# Altium schematic sheet 1010829PA_HVFlyback_GD_Testboard_Flyback.SchDoc: Flyback
size A4; CompanyName: drivetek ag; DrawnBy: NLE; Address1: industriestrasse 37; Address2: 2555 brügg; Address3: Switzerland; SheetNumber: 2; SheetTotal: 2
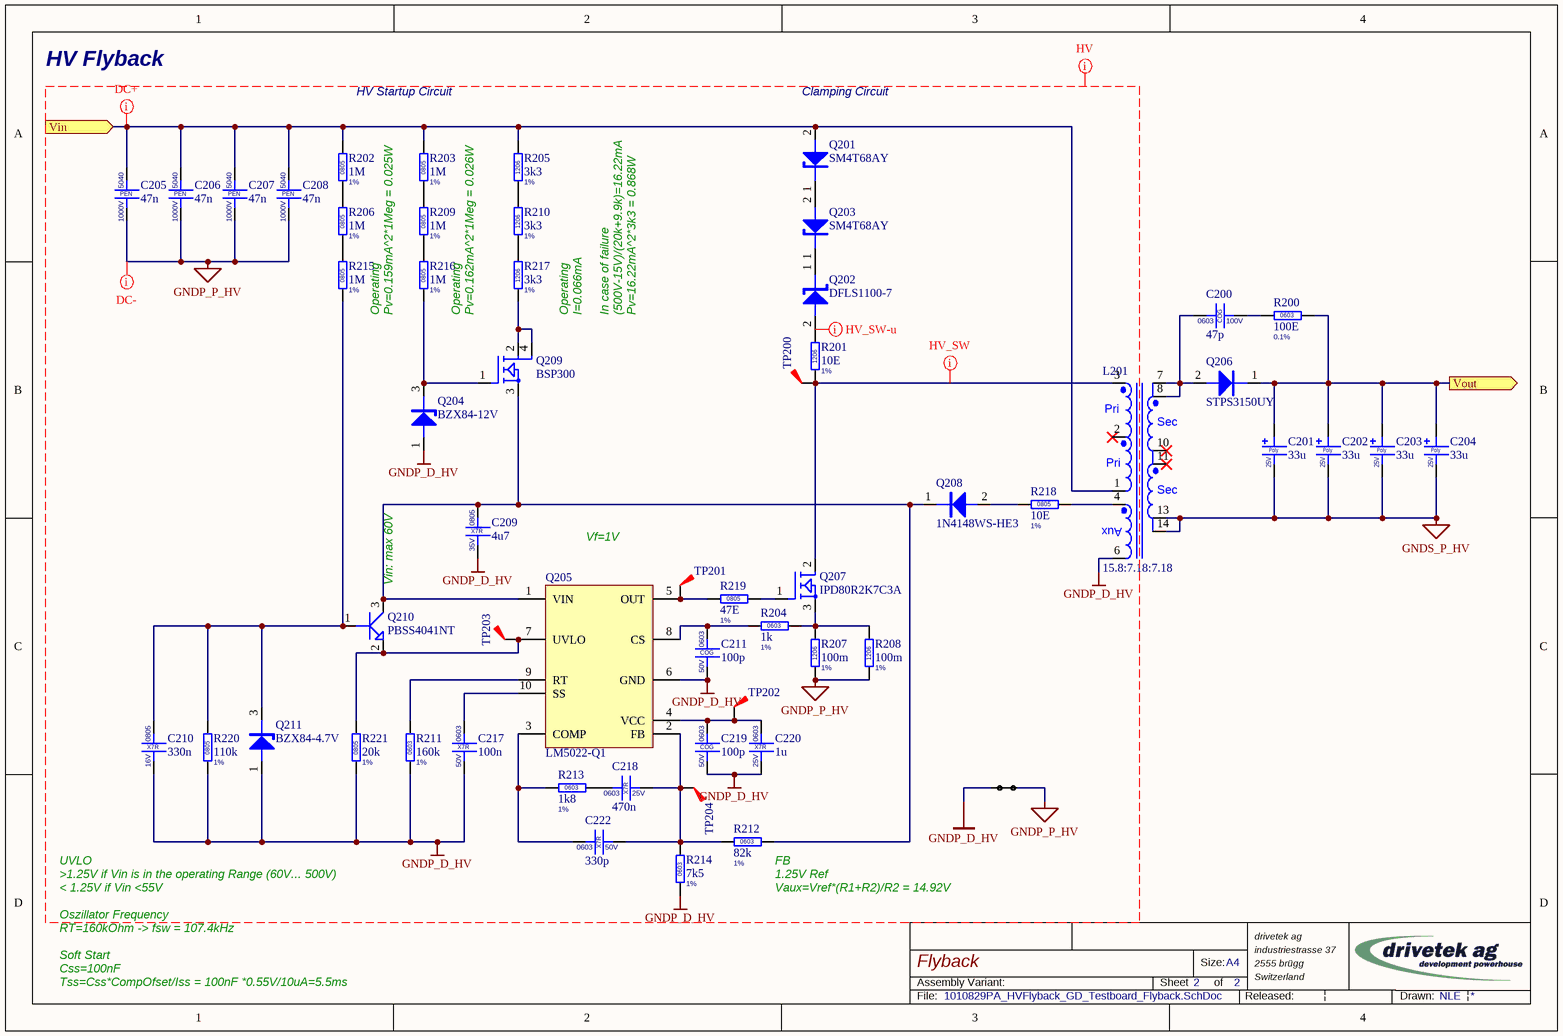
[diagram p0: 1010829PA_HVFlyback_GD_Testboard_Flyback.SchDoc]

## Parts
C200  47p  CaseName: 0603  Type3: COG  Voltage: 100V  [02_0603_DRK_1-7x1-0x0-9]
C201  33u  Voltage: 25V  Type2: Poly  [02_ELKO-SMD-4x7-4_DRK_4-3x7-3x1-9]
C202  33u  Voltage: 25V  Type2: Poly  [02_ELKO-SMD-4x7-4_DRK_4-3x7-3x1-9]
C203  33u  Voltage: 25V  Type2: Poly  [02_ELKO-SMD-4x7-4_DRK_4-3x7-3x1-9]
C204  33u  Voltage: 25V  Type2: Poly  [02_ELKO-SMD-4x7-4_DRK_4-3x7-3x1-9]
C205  47n  CaseName: 5040  Type3: PEN  Voltage: 1000V  [02_5040_DRK_3-5mm]
C206  47n  CaseName: 5040  Type3: PEN  Voltage: 1000V  [02_5040_DRK_3-5mm]
C207  47n  CaseName: 5040  Type3: PEN  Voltage: 1000V  [02_5040_DRK_3-5mm]
C208  47n  CaseName: 5040  Type3: PEN  Voltage: 1000V  [02_5040_DRK_3-5mm]
C209  4u7  CaseName: 0805  Type3: X7R  Voltage: 35V  [02_0805_DRK_2-2x1-5x1-3]
C210  330n  CaseName: 0805  Type3: X7R  Voltage: 16V  [02_0805_DRK_2-2x1-5x1-3]
C211  100p  CaseName: 0603  Type3: COG  Voltage: 50V  [02_0603_DRK_1-7x1-0x0-9]
C217  100n  CaseName: 0603  Type3: X7R  Voltage: 50V  [02_0603_DRK_1-7x1-0x0-9]
C218  470n  CaseName: 0603  Type3: X7R  Voltage: 25V  [02_0603_DRK_1-7x1-0x0-9]
C219  100p  CaseName: 0603  Type3: COG  Voltage: 50V  [02_0603_DRK_1-7x1-0x0-9]
C220  1u  CaseName: 0603  Type3: X7R  Voltage: 25V  [02_0603_DRK_1-7x1-0x0-9]
C222  330p  CaseName: 0603  Type3: X7R  Voltage: 50V  [02_0603_DRK_1-7x1-0x0-9]
J200  3x1top  [12_NetCon_top_3x1]  (value not drawn)  (net tie, no BOM)
L201  15.8:7.18:7.18  [06_TRA_DRK_WUERTH-750871630]
Q201  SM4T68AY  [03_SMA_DRK]
Q202  DFLS1100-7  [03_POWERDI_DRK]
Q203  SM4T68AY  [03_SMA_DRK]
Q204  BZX84-12V  [03_SOT23_DRK]
Q205  LM5022-Q1  [04_VSSOP-10_DRK]
Q206  STPS3150UY  [03_SMB_DRK]
Q207  IPD80R2K7C3A  [03_PG-TO252-3-11]
Q208  1N4148WS-HE3  [03_SOD323_DRK]
Q209  BSP300  [03_SOT-223_DRK]
Q210  PBSS4041NT  [03_SOT23_DRK]
Q211  BZX84-4.7V  [03_SOT23_DRK]
R200  100E  Tolerance: 0.1%  CaseName: 0603  [01_0603_DRK_1-7x1-0x0-55]
R201  10E  Tolerance: 1%  CaseName: 1206  [01_1206_DRK_3-4x1-8x0-65]
R202  1M  Tolerance: 1%  CaseName: 0805  [01_0805_DRK_2-2x1-5x0-65]
R203  1M  Tolerance: 1%  CaseName: 0805  [01_0805_DRK_2-2x1-5x0-65]
R204  1k  Tolerance: 1%  CaseName: 0603  [01_0603_DRK_1-7x1-0x0-55]
R205  3k3  Tolerance: 1%  CaseName: 1206  [01_1206_DRK_3-4x1-8x0-65]
R206  1M  Tolerance: 1%  CaseName: 0805  [01_0805_DRK_2-2x1-5x0-65]
R207  100m  Tolerance: 1%  CaseName: 1206  [01_1206_DRK_3-4x1-8x0-65]
R208  100m  Tolerance: 1%  CaseName: 1206  [01_1206_DRK_3-4x1-8x0-65]
R209  1M  Tolerance: 1%  CaseName: 0805  [01_0805_DRK_2-2x1-5x0-65]
R210  3k3  Tolerance: 1%  CaseName: 1206  [01_1206_DRK_3-4x1-8x0-65]
R211  160k  Tolerance: 1%  CaseName: 0603  [01_0603_DRK_1-7x1-0x0-55]
R212  82k  Tolerance: 1%  CaseName: 0603  [01_0603_DRK_1-7x1-0x0-55]
R213  1k8  Tolerance: 1%  CaseName: 0603  [01_0603_DRK_1-7x1-0x0-55]
R214  7k5  Tolerance: 1%  CaseName: 0603  [01_0603_DRK_1-7x1-0x0-55]
R215  1M  Tolerance: 1%  CaseName: 0805  [01_0805_DRK_2-2x1-5x0-65]
R216  1M  Tolerance: 1%  CaseName: 0805  [01_0805_DRK_2-2x1-5x0-65]
R217  3k3  Tolerance: 1%  CaseName: 1206  [01_1206_DRK_3-4x1-8x0-65]
R218  10E  Tolerance: 1%  CaseName: 0805  [01_0805_DRK_2-2x1-5x0-65]
R219  47E  Tolerance: 1%  CaseName: 0805  [01_0805_DRK_2-2x1-5x0-65]
R220  110k  Tolerance: 1%  CaseName: 0805  [01_0805_DRK_2-2x1-5x0-65]
R221  20k  Tolerance: 1%  CaseName: 0805  [01_0805_DRK_2-2x1-5x0-65]
TP200  TP SMD 1mm  [13_TP_1mm]  (value not drawn)  (no BOM)
TP201  TP SMD 1mm  [13_TP_1mm]  (value not drawn)  (no BOM)
TP202  TP SMD 1mm  [13_TP_1mm]  (value not drawn)  (no BOM)
TP203  TP SMD 1mm  [13_TP_1mm]  (value not drawn)  (no BOM)
TP204  TP SMD 1mm  [13_TP_1mm]  (value not drawn)  (no BOM)

## Ports
Vin (in), Vout (out)

## Nets
GNDP_D_HV: C209.2 C210.2 C211.2 C217.2 C219.2 C220.2 J200.1 L201.6 Q204.1 Q205.6(GND) Q211.1 R211.1 R214.1 R220.1 R221.1
GNDP_P_HV: C205.2 C206.2 C207.2 C208.2 J200.2 R207.1 R208.1
GNDS_P_HV: C201.2 C202.2 C203.2 C204.2 L201.13 L201.14
Vin: C205.1 C206.1 C207.1 C208.1 L201.1 Q201.2 R202.2 R203.2 R205.2 ; port Vin
Vout: C201.1 C202.1 C203.1 C204.1 Q206.1 R200.2 ; port Vout
NetC200_1: C200.1 L201.7 L201.8 Q206.2
NetC200_2: C200.2 R200.1
NetC209_1: C209.1 Q205.1(VIN) Q208.1 Q209.3 Q210.3 R212.2
NetC210_1: C210.1 Q210.1 Q211.3 R215.1 R220.2
NetC211_1: C211.1 Q205.8(CS) R204.1
NetC217_1: C217.1 Q205.10(SS)
NetC218_1: C218.1 R213.2
NetC218_2: C218.2 C222.2 Q205.2(FB) R212.1 R214.2 TP204.1
NetC219_1: C219.1 C220.1 Q205.4(VCC) TP202.1
NetC222_1: C222.1 Q205.3(COMP) R213.1
NetL201_3: L201.3 Q207.2 R201.2 TP200.1
NetL201_4: L201.4 R218.2
NetQ201_1: Q201.1 Q203.2
NetQ202_1: Q202.1 Q203.1
NetQ202_2: Q202.2 R201.1
NetQ204_3: Q204.3 Q209.1 R216.1
NetQ205_5: Q205.5(OUT) R219.1 TP201.1
NetQ205_7: Q205.7(UVLO) Q210.2 R221.2 TP203.1
NetQ205_9: Q205.9(RT) R211.2
NetQ207_1: Q207.1 R219.2
NetQ207_3: Q207.3 R204.2 R207.2 R208.2
NetQ208_2: Q208.2 R218.1
NetQ209_2: Q209.2 Q209.4 R217.1
NetR202_1: R202.1 R206.2
NetR203_1: R203.1 R209.2
NetR205_1: R205.1 R210.2
NetR206_1: R206.1 R215.2
NetR209_1: R209.1 R216.2
NetR210_1: R210.1 R217.2

Not connected (* = marked no-connect by the designer): L201 2* 10(7)* 11*

## Layout directives
net class HV: GNDP_D_HV, GNDP_P_HV
net class DC+: Vin
net class DC-: GNDP_P_HV
net class HV_SW: NetL201_3
net class HV_SW-u: NetQ202_2

## Notes on the sheet
- HV Flyback
- HV Startup Circuit
- (near Q201) Clamping Circuit
- Operating
- Pv=0.159mA^2*1Meg = 0.025W
- Pv=0.162mA^2*1Meg = 0.026W
- I=0.066mA
- In case of failure
- (500V-15V)/(20k+9.9k)=16.22mA
- Pv=16.22mA^2*3k3 = 0.868W
- (near Q210) Vin: max 60V
- Vf=1V
- >1.25V if Vin is in the operating Range (60V... 500V)
- < 1.25V if Vin <55V
- UVLO
- Oszillator Frequency
- (near R212) 1.25V Ref
- (near R212) FB
- (near R212) Vaux=Vref*(R1+R2)/R2 = 14.92V
- RT=160kOhm -> fsw = 107.4kHz
- Soft Start
- Css=100nF
- Tss=Css*CompOfset/Iss = 100nF *0.55V/10uA=5.5ms
- Assembly Variant:
- Sheet
- Size:
- of
- A4
- File:
- Released:
- |
- Drawn:
- (in symbol 06-0145) Pri; Sec; Aux

## Library data of the parts
C200 = 02-0270: Part Description: Ceramic 0603 47pF 100V COG Flexiterm; Manufacturer 1: Kemet; Manufacturer Part Number 1: C0603X470J1GACTU; LatestRevision Note: Initial; Type1: CAP; Type2: Ceramic; Tolerance: 5; Order Number: 80-C0603X470J1G; Part Number: 02-0270; Author: RLE; PartValue: 47p; ROHS: True; ComponentLink1Description: Datasheet; ComponentLink1URL: http://www.kemet.com/kemet/web/homepage/kechome.nsf/file/Flexible%20Termination%20Ceramic%20Chip%20Capacitors%20%28FT-CAP%29/$file/KEM_C1013_X7R_FT-CAP_SMD.pdf; LatestRevision Date: 22.06.2012; Distributor: Mouser; Price: 0.36
C201-C204 = 02-0399: Part Description: Polymer Aluminum 33uF 25V 4.3x7.3mm; Manufacturer 1: Panasonic; Manufacturer Part Number 1: EEF-HX1E330R; LatestRevision Note: Initial; Type1: ELKO; Tolerance: 20; Order Number: 667-EEF-HX1E330R; Part Number: 02-0399; Author: LME; PartValue: 33u; CaseName: SMD-4.3x7.3x1.9; ROHS: True; ComponentLink1Description: Datasheet; ComponentLink1URL: http://www.mouser.com/ds/2/315/ABE0000C90-1100919.pdf; LatestRevision Date: 21.12.2017; Distributor: Mouser; Price: 1.71
C205-C208 = 02-0364: Part Description: PEN film capacitor 47n 1000 V; Manufacturer 1: Kemet; Manufacturer Part Number 1: LDEQG2470KA5N00; LatestRevision Note: Initial; Type1: CAP; Type2: Foil; Tolerance: 10; Order Number: 80-LDEQG2470KA5N00; Part Number: 02-0364; Author: IKU; PartValue: 47n; ROHS: True; ComponentLink1Description: Datasheet; ComponentLink1URL: http://www.mouser.com/ds/2/212/KEM_F3078_LDE-462598.pdf; LatestRevision Date: 27.07.2016; Distributor: Mouser; Price: 3.56
C209 = 02-0353: Part Description: Ceramic 0805 4.7uF 35V X7R Automotive, flexiterm; Manufacturer 1: TDK; Manufacturer Part Number 1: CGA4J1X7R1V475K125AE; LatestRevision Note: Initial; Type1: CAP; Type2: Ceramic; Tolerance: 10; Order Number: 810-CGA4J1X7R1V475KE; Part Number: 02-0353; Author: RLE; PartValue: 4u7; ROHS: True; ComponentLink1Description: Datasheet; ComponentLink1URL: https://product.tdk.com/info/en/catalog/datasheets/mlcc_automotive_soft_en.pdf; LatestRevision Date: 13.04.2016; Distributor: Mouser; Price: 0.767
C210 = 02-0058: Part Description: Ceramic 0805 330n 16V X7R; Manufacturer 1: PHYCOMP; Manufacturer Part Number 1: 2238 910 15642; LatestRevision Note: Initial; Type1: CAP; Type2: Ceramic; Tolerance: 10; Checked: HHU; Order Number: 3188875; Part Number: 02-0058; Author: CBA; PartValue: 330n; ROHS: True; ComponentLink1Description: Datasheet; ComponentLink1URL: http://www.yageo.com/pdf/X7R_16-to-500V_9.pdf; LatestRevision Date: 18.11.2008; Distributor: Farnell; Price: 0.21
C211 C219 = 02-0380: Part Description: Ceramic 0603 100pF 50V 5% C0G  AEC-Q200; Manufacturer 1: Murata; Manufacturer Part Number 1: GCM1885C1H101JA16D; LatestRevision Note: Initial; Type1: CAP; Type2: Ceramic; Tolerance: 5; Order Number: 81-GCM1885C1H101JA6D; Part Number: 02-0380; Author: RLE; PartValue: 100p; ROHS: True; ComponentLink1Description: Datasheet; ComponentLink1URL: http://www.murata.com/products/catalog/pdf/c03e.pdf; LatestRevision Date: 12.09.2016; Distributor: Mouser; Price: 0.1
C217 = 02-0184: Part Description: Ceramic 0603 100n 50V X7R flexiterm; Manufacturer 1: AVX; Manufacturer Part Number 1: 06035C104KAZ2A; LatestRevision Note: Checked; Type1: CAP; Type2: Ceramic; Tolerance: 10; Checked: HHU; Order Number: 1301894; Part Number: 02-0184; Author: MSC; PartValue: 100n; ROHS: True; ComponentLink1Description: Datasheet; ComponentLink1URL: http://www.farnell.com/datasheets/111446.pdf; LatestRevision Date: 26.03.2009; Distributor: Farnell; Price: 0.23
C218 = 02-0206: Part Description: Automotive Caramic 0603 470nF 25V X7R; Manufacturer 1: muRata; Manufacturer Part Number 1: GCM188R71E474KA64D; LatestRevision Note: Checked; Type1: CAP; Type2: Ceramic; Tolerance: 10; Checked: CRA; Order Number: 490-4776-1-ND; Part Number: 02-0206; Author: RLE; PartValue: 470n; ROHS: True; ComponentLink1Description: Datasheet; ComponentLink1URL: http://search.murata.co.jp/Ceramy/image/img/PDF/ENG/GCM188R71E474KA64.pdf; LatestRevision Date: 06.08.2009; Distributor: Digikey; Price: 0.03
C220 = 02-0275: Part Description: Ceramic 0603 1u 25V 10% X7R Automotive; Manufacturer 1: TDK; Manufacturer Part Number 1: CGA3E1X7R1E105K; LatestRevision Note: Initial; Type1: CAP; Type2: Ceramic; Tolerance: 10; Order Number: 810-CGA3E1X7R1E105K; Order Number 2: 445-6931-1-ND; Part Number: 02-0275; Author: SSC; PartValue: 1u; ROHS: True; ComponentLink1Description: Datasheet; ComponentLink1URL: http://www.tdk.co.jp/tefe02/e412_cga.pdf; LatestRevision Date: 25.06.2012; Distributor: Mouser; Price: 0.27; Distributor 2: Digikey
C222 = 02-0026: Part Description: Ceramic 0603 330p 50V X7R; Manufacturer 1: PHYCOMP; Manufacturer Part Number 1: CC0603KRX7R9BB331; LatestRevision Note: Checked; Type1: CAP; Type2: Ceramic; Tolerance: 10; Checked: HHU; Order Number: 722145; Part Number: 02-0026; Author: CBA; PartValue: 330p; ROHS: True; ComponentLink1Description: Datasheet; ComponentLink1URL: http://www.yageo.com/pdf/X7R_16-to-500V_9.pdf; LatestRevision Date: 09.12.2008; Distributor: Farnell; Price: 0.08
J200 = 12-0017: NetCon; LatestRevision Note: Initial; Part Number: 12-0017; Author: MSC; Type1: NetCon; PartValue: 3x1top; ROHS: False; Part Description: NetCon; ComponentLink1Description: Datasheet; LatestRevision Date: 07.02.2008; Price: 0
L201 = 06-0145: Flyback Transformer on Würth 070-6258 Bobbin; Part Description: Midcom THT Flyback Transformer 15.8:7.18:7.18, Lp=500uH; Manufacturer Part Number 1: 750871630; LatestRevision Note: Initial; Type1: TRA; Current: 1A527; Order Number: 710-750871630; Order Number 2: 732-2237-ND; Part Number: 06-0145; Author: NLE; PartValue: 15.8:7.18:7.18; CaseName: EE20/10/6; ROHS: True; ComponentLink1Description: Datasheet; ComponentLink1URL: http://katalog.we-online.de/ctm/datasheet/750871630.pdf; LatestRevision Date: 02.01.2018; Manufacturer 1: Würth; Distributor: Mouser; Price: 8.86; Distributor 2: Digikey
Q201 Q203 = 03-0427: Part Description: TVS Diode unidirektional 68V, 400Wp, AEC-Q101; Manufacturer 1: ST; LatestRevision Note: Initial; Type1: TVS; Type2: Power; Voltage: 58V; Current: 4A3; Order Number: 511-SM4T68AY; Part Number: 03-0427; Author: NLE; PartValue: SM4T68AY; CaseName: SMA; ROHS: True; ComponentLink1Description: Datasheet; ComponentLink1URL: http://www.mouser.com/ds/2/389/sm4ty-955192.pdf; LatestRevision Date: 02.01.2018; Manufacturer Part Number 1: SM4T68AY; Distributor: Mouser; Price: 0.81
Q202 = 03-0225: Part Description: Schottky Diode 100V, 1A, PowerDI123; Manufacturer 1: Diodes Inc; LatestRevision Note: Initial; Type1: DIODE; Type2: Power; Voltage: 100V; Current: 1A; Order Number: 621-DFLS1100-7; Part Number: 03-0225; Author: CSI; PartValue: DFLS1100-7; CaseName: POWERDI123; ROHS: True; ComponentLink1Description: Datasheet; ComponentLink1URL: http://www.diodes.com/datasheets/ds30497.pdf; LatestRevision Date: 24.04.2013; Manufacturer Part Number 1: DFLS1100-7; Distributor: Mouser; Price: 0.6
Q204 = 03-0210: Part Description: Zener Diode 250mW 5%, AEC-Q101; Manufacturer 1: NXP; Manufacturer Part Number 1: BZX84-C12/T1; LatestRevision Note: Initial; Type1: ZDIODE; Voltage: 12V; Order Number: 1081407; Part Number: 03-0210; PartValue: BZX84-12V; CaseName: SOT23; ROHS: True; ComponentLink1Description: Datasheet; ComponentLink1URL: http://www.nxp.com/documents/data_sheet/BZX84_SERIES.pdf; LatestRevision Date: 03.07.2012; Distributor: Farnell; Price: 0.18
Q205 = 04-0502: Part Description: 2.2MHz, 60 V Low-Side Controller For Boost and SEPIC; Manufacturer 1: TI; Manufacturer Part Number 1: LM5022QDGSRQ1; LatestRevision Note: Initial; Type1: SPREG; Order Number: 595-LM5022QDGSRQ1; Type2: Switching; Order Number 2: 296-47208-1-ND; Part Number: 04-0502; Author: LME; PartValue: LM5022-Q1; CaseName: VSSOP-10; ROHS: True; ComponentLink1Description: Datasheet; ComponentLink1URL: http://www.ti.com/lit/ds/symlink/lm5022-q1.pdf; LatestRevision Date: 19.12.2017; Distributor: Mouser; Price: 2.32; Distributor 2: DigiKey
Q206 = 03-0428: Part Description: Schottky 3A 150V VRRM 0.67VF 200V/2A AEC-Q101; Manufacturer 1: ST; LatestRevision Note: Initial; Type1: DIODE; Type2: Power; Voltage: 150V; Current: 3A; Order Number: 511-STPS3150UY; Part Number: 03-0428; Author: NLE; PartValue: STPS3150UY; CaseName: SMB; ROHS: True; ComponentLink1Description: Datasheet; ComponentLink1URL: http://www.mouser.com/ds/2/389/stps3150-y-956515.pdf; LatestRevision Date: 02.01.2018; Manufacturer Part Number 1: STPS3150UY; Manufacturer 2: ES2D-E3/52T; Distributor: Mouser; Price: 0.68
Q207 = 03-0426: Part Description: 800V N-Channel MOSFET, AEC-Q101; Manufacturer 1: Infineon; Manufacturer Part Number 1: IPD80R2K7C3AATMA1; LatestRevision Note: Initial; Type1: NMOS; Type2: Power; Voltage: 800V; Current: 2A; Order Number: 726-IPD80R2K7C3AATMA; Part Number: 03-0426; Author: NLE; PartValue: IPD80R2K7C3A; CaseName: PG-TO252-3; ROHS: True; ComponentLink1Description: Datasheet; ComponentLink1URL: https://www.infineon.com/dgdl/Infineon-IPD80R2K7C3A-DS-v01_01-EN.pdf?fileId=5546d4625e763904015ec2d9c72064a0; LatestRevision Date: 02.01.2018; Distributor: Mouser; Price: 1.45
Q208 = 03-0429: Part Description: Small signal switching diode 150mA 100V AEC-Q101; Manufacturer 1: Vishay; Manufacturer Part Number 1: 1N4148WS-HE3-18; LatestRevision Note: Initial; Type1: DIODE; Type2: Signal; Voltage: 100V; Current: 150m; Order Number: 78-1N4148WS-HE3-18; Part Number: 03-0429; Author: NLE; PartValue: 1N4148WS-HE3; CaseName: SOD323; ROHS: True; ComponentLink1Description: Datasheet; ComponentLink1URL: http://www.vishay.com/docs/85751/1n4148ws.pdf; LatestRevision Date: 03.01.2018; Distributor: Mouser; Price: 0.245
Q209 = 03-0432: Part Description: N-channel MOSFET 800V 190mA AECQ-101; Manufacturer 1: Infineon; Manufacturer Part Number 1: BSP300H6327XUSA1; LatestRevision Note: Initial; Type1: NMOS; Type2: Signal; Voltage: 800V; Current: 0A19; Order Number: 726-BSP300H6327XUSA1; Part Number: 03-0432; Author: NLE; PartValue: BSP300; CaseName: PG-SOT223; ROHS: True; ComponentLink1Description: Datasheet; ComponentLink1URL: http://www.mouser.com/ds/2/196/Infineon-BSP300-DS-v02_02-en-1226332.pdf; LatestRevision Date: 08.01.2018; Distributor: Mouser; Price: 0.96
Q210 = 03-0198: Part Description: TRANSISTOR NPN,60V,3.8A,SOT23; Manufacturer 1: NXP; LatestRevision Note: Initial; Type1: NPN; Type2: Power; Voltage: 60V; Current: 3A8; Order Number: 771-PBSS4041NT215; Order Number 2: 568-5069-1-ND; Part Number: 03-0198; Author: SSC; PartValue: PBSS4041NT; CaseName: SOT23; ROHS: True; ComponentLink1Description: Datasheet; ComponentLink1URL: http://www.nxp.com/documents/data_sheet/PBSS4041NT.pdf; LatestRevision Date: 25.05.2012; Manufacturer Part Number 1: PBSS4041NT; Distributor: Mouser; Price: 0.179; Distributor 2: DigiKey
Q211 = 03-0027: Part Description: Zener Diode 250mW 5%; Manufacturer 1: NXP; Manufacturer Part Number 1: BZX84-C4V7; LatestRevision Note: Initial; Type1: ZDIODE; Voltage: 4V7; Order Number: 1081428; Part Number: 03-0027; Author: CBA; PartValue: BZX84-4.7V; CaseName: SOT23; ROHS: True; ComponentLink1Description: Datasheet; ComponentLink1URL: http://www.nxp.com/documents/data_sheet/BZX84_SERIES.pdf; LatestRevision Date: 05.10.2006; Distributor: Farnell; Price: 0.19
R200 = 01-0584: Part Description: 0603 100R 75V 0.1W 0.1% 25ppm AEC-Q200; Manufacturer 1: Vishay; Manufacturer Part Number 1: TNPW0603100RBEEA; LatestRevision Note: Initial; Type1: RES; Type2: Metalfilm; Voltage: 75V; Power: 100m; Order Number: 71-TNPW0603100RBEEA; Part Number: 01-0584; Author: MFR; PartValue: 100E; ROHS: True; ComponentLink1Description: Datasheet; ComponentLink1URL: http://www.vishay.com/docs/28758/tnpw_e3.pdf; LatestRevision Date: 18.06.2012; Distributor: Mouser; Price: 0.4
R201 = 01-0261: Part Description: 1206 10E 200V 0.125W 1%; Manufacturer 1: Multicomp; Manufacturer Part Number 1: MC 0.125W1206 1% 10R; LatestRevision Note: Checked; Type1: RES; Type2: Thickfilm; Voltage: 200V; Power: 125m; Checked: CBA; Order Number: 9335790; Part Number: 01-0261; Author: CBA; PartValue: 10E; ROHS: True; ComponentLink1Description: Datasheet; ComponentLink1URL: http://www.farnell.com/datasheets/90824.pdf; LatestRevision Date: 06.10.2006; Distributor: Farnell; Price: 0.055
R202 R203 R206 R209 R215 R216 = 01-0158: Part Description: 0805 1M 150V 0.1W 1%; Manufacturer 1: Multicomp; Manufacturer Part Number 1: MC 0.1W 0805 1% 1M; LatestRevision Note: Checked; Type1: RES; Type2: Thickfilm; Voltage: 150V; Power: 100m; Checked: CBA; Order Number: 9332413; Part Number: 01-0158; Author: CBA; PartValue: 1M; ROHS: True; ComponentLink1Description: Datasheet; ComponentLink1URL: http://www.farnell.com/datasheets/90824.pdf; LatestRevision Date: 06.10.2006; Distributor: Farnell; Price: 0.055
R204 = 01-0003: Part Description: 0603 1k 50V 0.063W 1%; Manufacturer 1: Multicomp; Manufacturer Part Number 1: MC 0.063W 0603 1% 1K; LatestRevision Note: Checked; Type1: RES; Type2: Thickfilm; Voltage: 50V; Power: 63m; Checked: CBA; Order Number: 9330380; Part Number: 01-0003; Author: CBA; PartValue: 1k; ROHS: True; ComponentLink1Description: Datasheet; ComponentLink1URL: http://www.farnell.com/datasheets/90824.pdf; LatestRevision Date: 06.10.2006; Distributor: Farnell; Price: 0.055
R205 R210 R217 = 01-0317: Part Description: 1206 3k3 200V 0.125W 1%; Manufacturer 1: Multicomp; Manufacturer Part Number 1: MC 0.125W1206 1% 3K3; LatestRevision Note: Checked; Type1: RES; Type2: Thickfilm; Voltage: 200V; Power: 125m; Checked: CBA; Order Number: 9336362; Part Number: 01-0317; Author: CBA; PartValue: 3k3; ROHS: True; ComponentLink1Description: Datasheet; ComponentLink1URL: http://www.farnell.com/datasheets/90824.pdf; LatestRevision Date: 06.10.2006; Distributor: Farnell; Price: 0.055
R207 R208 = 01-0780: Part Description: 1206 100m 200V 0.5W 1% AEC-Q200; Manufacturer 1: TT Electronics; Manufacturer Part Number 1: LR1206-R10FW; LatestRevision Note: Initial; Type1: RES; Type2: Thickfilm; Voltage: 200V; Power: 500m; Order Number: 1099914; Order Number 2: 756-LR1206-R10FW; Part Number: 01-0780; Author: LME; PartValue: 100m; ROHS: True; ComponentLink1Description: Datasheet; ComponentLink1URL: http://www.ttelectronics.com/sites/default/files/resistors-datasheets/LR.pdf; LatestRevision Date: 21.12.2017; Distributor: Farnell; Price: 0.651; Distributor 2: Mouser
R211 = 01-0032: Part Description: 0603 160k 50V 0.063W 1%; Manufacturer 1: Multicomp; Manufacturer Part Number 1: MC 0.063W 0603 1% 160K; LatestRevision Note: Checked; Type1: RES; Type2: Thickfilm; Voltage: 50V; Power: 63m; Checked: CBA; Order Number: 9330682; Part Number: 01-0032; Author: CBA; PartValue: 160k; ROHS: True; ComponentLink1Description: Datasheet; ComponentLink1URL: http://www.farnell.com/datasheets/90824.pdf; LatestRevision Date: 06.10.2006; Distributor: Farnell; Price: 0.055
R212 = 01-0120: Part Description: 0603 82k 50V 0.063W 1%; Manufacturer 1: Multicomp; Manufacturer Part Number 1: MC 0.063W 0603 1% 82K; LatestRevision Note: Checked; Type1: RES; Type2: Thickfilm; Voltage: 50V; Power: 63m; Checked: CBA; Order Number: 9331573; Part Number: 01-0120; Author: CBA; PartValue: 82k; ROHS: True; ComponentLink1Description: Datasheet; ComponentLink1URL: http://www.farnell.com/datasheets/90824.pdf; LatestRevision Date: 06.10.2006; Distributor: Farnell; Price: 0.055
R213 = 01-0035: Part Description: 0603 1k8 50V 0.063W 1%; Manufacturer 1: Multicomp; Manufacturer Part Number 1: MC 0.063W 0603 1% 1K8; LatestRevision Note: Checked; Type1: RES; Type2: Thickfilm; Voltage: 50V; Power: 63m; Checked: CBA; Order Number: 9330712; Part Number: 01-0035; Author: CBA; PartValue: 1k8; ROHS: True; ComponentLink1Description: Datasheet; ComponentLink1URL: http://www.farnell.com/datasheets/90824.pdf; LatestRevision Date: 06.10.2006; Distributor: Farnell; Price: 0.06
R214 = 01-0114: Part Description: 0603 7k5 50V 0.063W 1%; Manufacturer 1: Multicomp; Manufacturer Part Number 1: MC 0.063W 0603 1% 7K5; LatestRevision Note: Checked; Type1: RES; Type2: Thickfilm; Voltage: 50V; Power: 63m; Checked: CBA; Order Number: 9331514; Part Number: 01-0114; Author: CBA; PartValue: 7k5; ROHS: True; ComponentLink1Description: Datasheet; ComponentLink1URL: http://www.farnell.com/datasheets/90824.pdf; LatestRevision Date: 06.10.2006; Distributor: Farnell; Price: 0.055
R218 = 01-0159: Part Description: 0805 10E 150V 0.1W 1%; Manufacturer 1: Multicomp; Manufacturer Part Number 1: MC 0.1W 0805 1% 10R; LatestRevision Note: Checked; Type1: RES; Type2: Thickfilm; Voltage: 150V; Power: 100m; Checked: CBA; Order Number: 9332421; Part Number: 01-0159; Author: CBA; PartValue: 10E; ROHS: True; ComponentLink1Description: Datasheet; ComponentLink1URL: http://www.farnell.com/datasheets/90824.pdf; LatestRevision Date: 06.10.2006; Distributor: Farnell; Price: 0.055
R219 = 01-0217: Part Description: 0805 47E 150V 0.1W 1%; Manufacturer 1: Multicomp; Manufacturer Part Number 1: MC 0.1W 0805 1% 47R; LatestRevision Note: Checked; Type1: RES; Type2: Thickfilm; Voltage: 150V; Power: 100m; Checked: CBA; Order Number: 9333290; Part Number: 01-0217; Author: CBA; PartValue: 47E; ROHS: True; ComponentLink1Description: Datasheet; ComponentLink1URL: http://www.farnell.com/datasheets/90824.pdf; LatestRevision Date: 06.10.2006; Distributor: Farnell; Price: 0.055
R220 = 01-0163: Part Description: 0805 110k 150V 0.1W 1%; Manufacturer 1: Multicomp; Manufacturer Part Number 1: MC 0.1W 0805 1% 110K; LatestRevision Note: Checked; Type1: RES; Type2: Thickfilm; Voltage: 150V; Power: 100m; Checked: CBA; Order Number: 9332464; Part Number: 01-0163; Author: CBA; PartValue: 110k; ROHS: True; ComponentLink1Description: Datasheet; ComponentLink1URL: http://www.farnell.com/datasheets/90824.pdf; LatestRevision Date: 06.10.2006; Distributor: Farnell; Price: 0.055
R221 = 01-0143: Part Description: 0805 20k 150V 0.1W 1%; Manufacturer 1: Multicomp; Manufacturer Part Number 1: MC 0.1W 0805 1% 20K; LatestRevision Note: Checked; Type1: RES; Type2: Thickfilm; Voltage: 150V; Power: 100m; Checked: CBA; Order Number: 9332774; Part Number: 01-0143; Author: CBA; PartValue: 20k; ROHS: True; ComponentLink1Description: Datasheet; ComponentLink1URL: http://www.farnell.com/datasheets/90824.pdf; LatestRevision Date: 06.10.2006; Distributor: Farnell; Price: 0.055
TP200-TP204 = 13-0304: Part Description: Test point SMD - Dia 1mm; LatestRevision Note: Initial; Part Number: 13-0304; Author: CSI; Type1: TP; Type2: SMD; PartValue: TP SMD 1mm; CaseName: 1mm; ROHS: True; ComponentLink1Description: Datasheet; LatestRevision Date: 13.12.2012; Price: 0